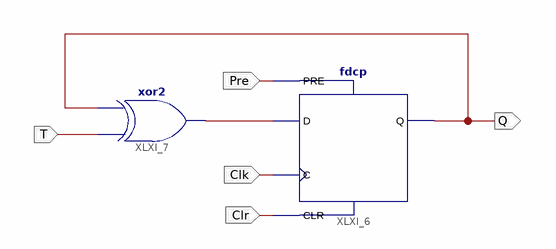
[diagram p0: schematic sheet 1]
// Xilinx ISE schematic FF_T.sch (spartan3e) as structural Verilog: 2 symbols, 5 ports
module FF_T (
  input  T,
  input  Pre,
  input  Clk,
  input  Clr,
  output Q
);

  wire XLXN_1;

  fdcp XLXI_6 (.C(Clk), .CLR(Clr), .D(XLXN_1), .PRE(Pre), .Q(Q));
  xor XLXI_7 (XLXN_1, T, Q);
endmodule
